# EAGLE design Komfortblinker_ATTINY13 (EAGLE 8.0.1)
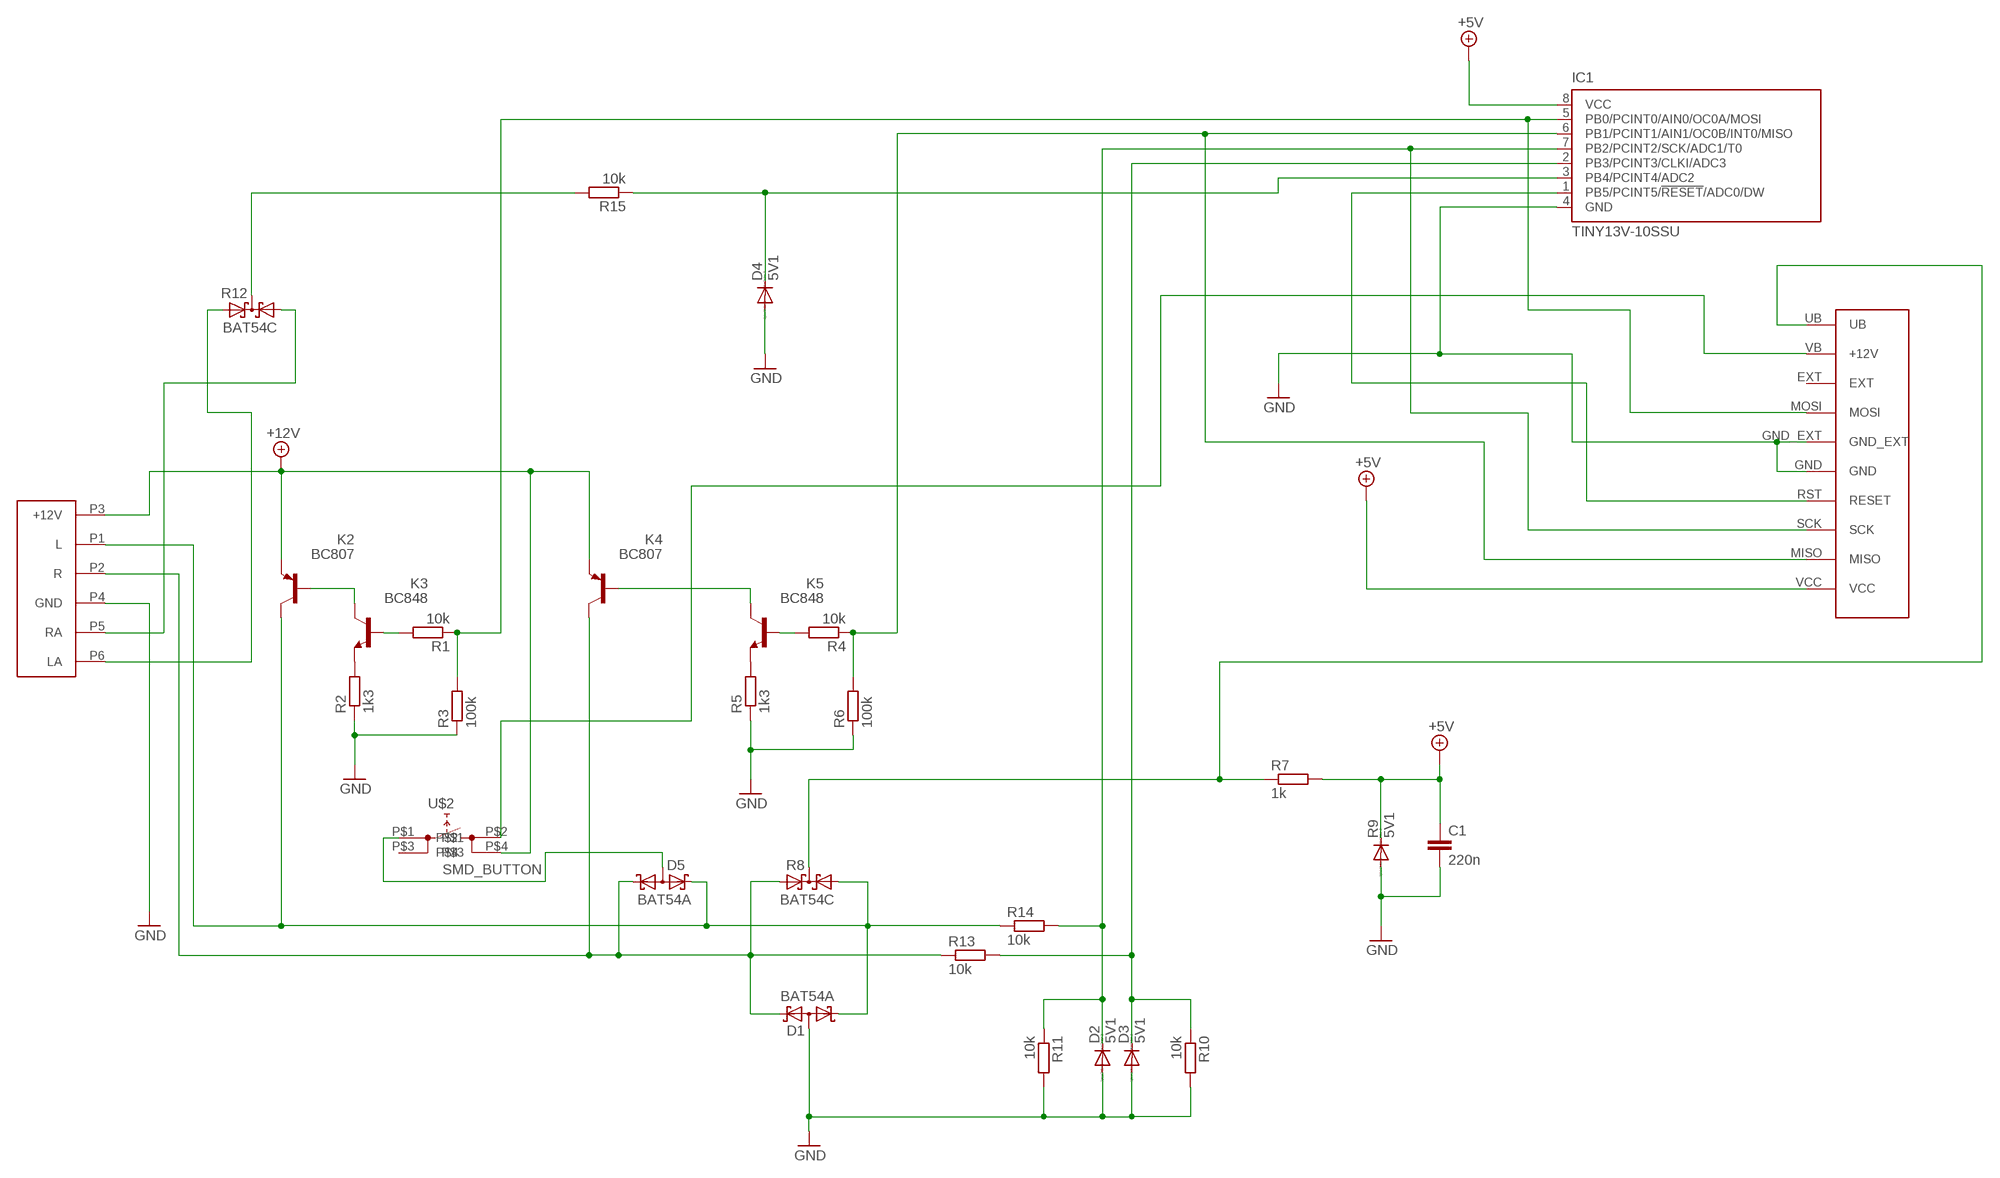
[diagram p0: schematic, sheet 1]

## Parts
C1  220n  C-EUC0805  [C0805]
D1  BAT54A  [SOT23]
D2  5V1  DIODE-SOD123  [SOD123]
D3  5V1  DIODE-SOD123  [SOD123]
D4  5V1  DIODE-SOD123  [SOD123]
D5  BAT54A  [SOT23]
IC1  TINY13V-10SSU  [8S1]
K2  BC807  BC858A-PNP-SOT23-BEC  [SOT23-BEC]
K3  BC848  [SOT23]
K4  BC807  BC858A-PNP-SOT23-BEC  [SOT23-BEC]
K5  BC848  [SOT23]
R1  10k  R-EU_R0805  [R0805]
R2  1k3  R-EU_R0805  [R0805]
R3  100k  R-EU_R0805  [R0805]
R4  10k  R-EU_R0805  [R0805]
R5  1k3  R-EU_R0805  [R0805]
R6  100k  R-EU_R0805  [R0805]
R7  1k  R-EU_M0805  [M0805]
R8  BAT54C  [SOT23]
R9  5V1  DIODE-MINIMELF  [MINIMELF]
R10  10k  R-EU_R0805  [R0805]
R11  10k  R-EU_R0805  [R0805]
R12  BAT54C  [SOT23]
R13  10k  R-EU_M0805  [M0805]
R14  10k  R-EU_M0805  [M0805]
R15  10k  R-EU_R0805  [R0805]
U$2  SMD_BUTTON  [SMD_BUTTON]
U$3  PROGRAMMING  [PROGRAMMING]
U$4  CON-KOMFORT  [CON-KOMFORT]

## Nets
+5V: C1.1 IC1.8(VCC) R7.2 R9.C U$3.VCC
+12V: K2.E K4.E U$2.P$4 U$4.P3(+12V)
+12V2: U$2.P$2 U$3.VB(+12V)
BK2: K2.B K3.3(C)
BK3: K3.1(B) R1.2
BK4: K4.B K5.3(C)
BK5: K5.1(B) R4.2
FB: D4.C IC1.3(PB4/PCINT4/ADC2) R15.1
GND: C1.2 D1.3(AA) D2.A D3.A D4.A IC1.4(GND) R2.1 R3.1 R5.1 R6.1 R9.A R10.2 R11.2 U$3.GND U$3.GND_EXT U$4.P4(GND)
L: D1.1(K1) D5.2(K2) K2.C R8.1(A1) R14.1 U$4.P1(L)
L2: D2.C IC1.7(PB2/PCINT2/SCK/ADC1/T0) R11.1 R14.2 U$3.SCK
LA: R12.2(A2) U$4.P6(LA)
LRA: R12.3(CC) R15.2
LS: IC1.5(PB0/PCINT0/AIN0/OC0A/MOSI) R1.1 R3.2 U$3.MOSI
N$5: K5.2(E) R5.2
N$6: K3.2(E) R2.2
N$9: D5.3(AA) U$2.P$1
R: D1.2(K2) D5.1(K1) K4.C R8.2(A2) R13.1 U$4.P2(R)
R2: D3.C IC1.2(PB3/PCINT3/CLKI/ADC3) R10.1 R13.2
RA: R12.1(A1) U$4.P5(RA)
RESET: IC1.1(PB5/PCINT5/!RESET!/ADC0/DW) U$3.RST(RESET)
RS: IC1.6(PB1/PCINT1/AIN1/OC0B/INT0/MISO) R4.1 R6.2 U$3.MISO
UB: R7.1 R8.3(CC) U$3.UB
Unconnected: U$2.P$3 U$3.EXT

## Library data of the parts
C1 = rcl:C-EU: CAPACITOR, European symbol
D1 D5 = diode:BAT54A: Schottky Diodes Source: Fairchild .. BAT54.pdf
D2-D4 R9 = diode:DIODE-: DIODE
IC1 = atmel_steven:TINY13: 8-bit AVR Microcontroller with 1K Bytes In-System Programmable Flash Source: http://www.atmel.com/dyn/resources/prod_documents/2535S.pdf; MPN: ATTINY13V-10SSU; OC_FARNELL: 1455135; OC_NEWARK: 58M3773
K2 K4 = transistor:*-PNP-: PNP Transistror
K3 K5 = transistor:BC848: NPN TRANSISTOR
R1-R7 R10 R11 R13-R15 = rcl:R-EU_: RESISTOR, European symbol
R8 R12 = diode:BAT54C: Schottky Diodes Source: Fairchild .. BAT54.pdf
U$2 = SMD_Button:SMD_BUTTON
U$3 = Programming_Connector:PROGRAMMING
U$4 = CON-Komfort_2:CON-KOMFORT

## Board
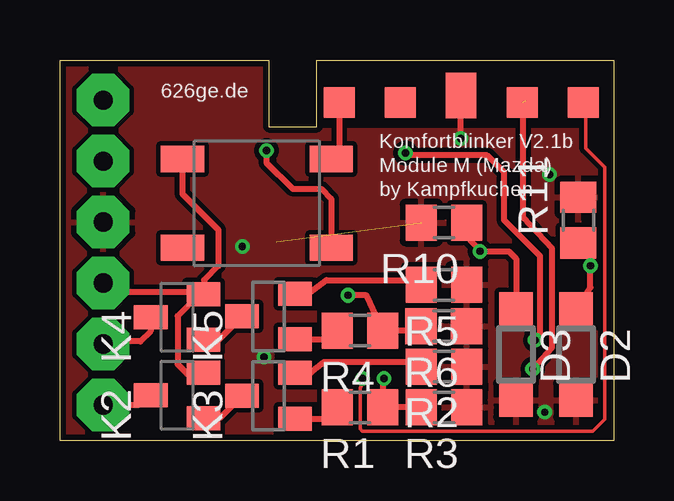
[diagram p1: board, top side]
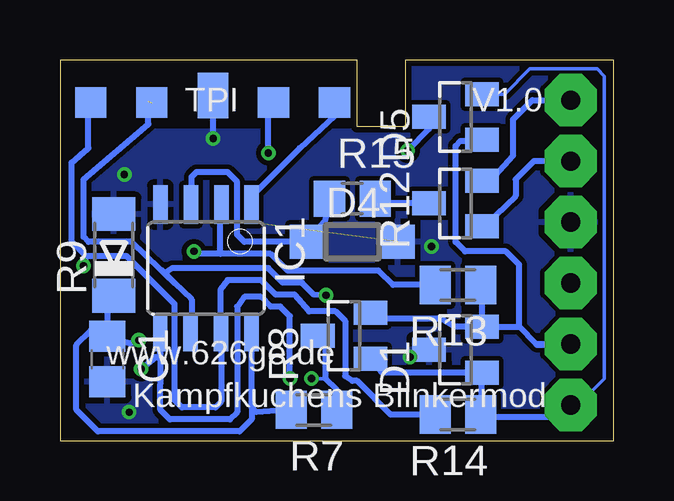
[diagram p2: board, bottom side, seen from below]

Size 23.08 x 15.87 mm. Coordinates in mm from the lower left corner, seen from the top.
Outline: 23.08,15.87 23.08,15.87
Outline: 0,15.87 0,15.87
Outline: 0,15.87 0,0 23.08,0 23.08,15.87
Outline: 0,15.87 8.7,15.87 8.7,13.1 10.7,13.1 10.7,15.87 23.08,15.87
Copper layers (1*16): Top 0.035mm / dielectric 1.5mm / Bottom 0.035mm
Design rules "dirt_cheap_dirty_boards.v1 *": minimum track width 5mil, minimum drill 8mil, track to track 5mil, track to pad 5mil, pad to pad 5mil, via to via 5mil, smd to smd 0mil, copper to edge 10mil, drill to drill 10mil, minimum pad ring 10mil, minimum via ring 6mil, stop-mask expansion 2mil, vias tented up to drill 25mil, thermal gap 10mil

### Footprints (pad centres in the part's own frame; a part is rotated, then mirrored left to right if it is on the bottom)
C0805 = smd 1.3 x 1.5: 1 -0.95,0; 2 0.95,0
SOT23 = smd 1 x 1.4: 1 -0.95,-1.1; 2 0.95,-1.1; 3 0,1.1
SOD123 = smd 1.4 x 1.4: A 1.9,0; C -1.9,0
8S1 = smd 0.6 x 1.6: 1 -1.905,-2.654; 2 -0.645,-2.654; 3 0.625,-2.654; 4 1.895,-2.654; 5 1.905,2.654; 6 0.635,2.654; 7 -0.635,2.654; 8 -1.905,2.654
SOT23-BEC = smd 1 x 1.4: B -0.95,-1.1; C 0,1.1; E 0.95,-1.1
R0805 = smd 1.3 x 1.5: 1 -0.95,0; 2 0.95,0
M0805 = smd 1.3 x 1.6: 1 -0.95,0; 2 0.95,0
MINIMELF = smd 1.4 x 1.8: A 1.7,0; C -1.7,0
SMD_BUTTON = smd 1.8 x 1.1: P$1 -3.1,1.85; P$2 -3.1,-1.85; P$3 3.1,1.85; P$4 3.1,-1.85
PROGRAMMING = smd 1.3 x 1.27: EXT -7.62,0; MOSI -2.54,0; UB 0,0; VB -10.16,0 | smd 1.27 x 1.9 bottom: GND -5.1,0.3 | smd 1.27 x 1.9: GND_EXT -5.1,0.3 | smd 1.3 x 1.27 bottom: MISO -2.54,0; RST -10.16,0; SCK 0,0; VCC -7.62,0
CON-KOMFORT = drill 0.8 pad 2.184 octagon: P1 0,0; P2 2.54,0; P3 5.08,0; P4 7.62,0; P5 10.16,0; P6 12.7,0

### Placement (x,y rotation side)
C1  21.1,3.42 270 bottom
D1  6.6,3.8 90 bottom
D2  21.5,3.6 270 top
D3  19,3.6 270 top
D4  10.9,8.3 0 bottom
D5  6.6,13.5 90 bottom
IC1  17,7.2 180 bottom
K2  4.88,1.9 90 top
K3  8.69,1.89 90 top
K4  4.88,5.16 90 top
K5  8.69,5.19 90 top
R1  12.5,1.4 180 top
R2  16,3.1 180 top
R3  16,1.4 180 top
R4  12.5,4.6 180 top
R5  16,6.5 180 top
R6  15.99,4.78 180 top
R7  12.5,1.3 180 bottom
R8  11.24,4.39 90 bottom
R9  20.84,7.75 90 bottom
R10  16,9.1 180 top
R11  21.6,9.2 90 top
R12  6.6,9.9 90 bottom
R13  6.5,6.5 180 bottom
R14  6.5,1.1 180 bottom
R15  10.9,10.1 0 bottom
U$2  8.2,9.9 180 top
U$3  21.8,14.1 0 top
U$4  1.8,1.5 90 top

### Tracks (layer width: path | path; a pad name or v marks a point on that pad's centre or on a via)
+5V  (via drill 0.3 pad 0.61)
  Top 0.254: v19.8,4.2 20,4.5 20,7.7 18.5,9.2 18.5,11.2 17.8,11.9 14.5,11.9 v14.4,12
  Bottom 0.254: C1.1 21.1,6.02 R9.C | R7.2 14.9,1.2 15.1,1.4 | 15.1,1.4 15.1,0.9 15.6,0.4 21.5,0.4 22.4,1.3 22.4,4 21.8,4.6 21.34,4.6 C1.1 | C1.1 20.17,4.07 v19.8,4.2 | v14.4,12 14.4,14.18 U$3.VCC | 15.1,1.4 15.1,2.39 IC1.8
+12V
  Top 0.254: 6,6.13 5.8,6.2 2.28,6.2 U$4.P3 | K2.E 5.93,2.8 5.3,2.8 4.9,3.2 4.9,5.2 5.81,6.11 K4.E 6,6.13 | U$2.P$4 5.1,10.3 6.6,8.8 6.6,7.3 6,6.7 6,6.13
+12V2
  Top 0.254: 11.3,13.76 U$3.VB 11.64,12.09 U$2.P$2
BK2
  Top 0.254: K2.B 6.66,0.95 K3.3
BK3
  Top 0.254: K3.1 11.32,0.94 R1.2
BK4
  Top 0.254: K4.B 6.61,4.21 K5.3
BK5
  Top 0.254: K5.1 11.19,4.24 R4.2
FB
  Bottom 0.254: R15.1 12.05,9.15 D4.C 15.4,8.3 15.7,8.6 15.7,10.8 16.1,11.2 17.4,11.2 17.6,11 17.6,10.3 | 17.6,10.3 17.6,9.43 | IC1.3 17.62,10.28 17.6,10.3
GND  (via drill 0.3 pad 0.61)  (1 unrouted)
  Top 0.254: v16.7,12.6 U$3.GND
  Bottom 0.254: v16.7,12.6 U$3.GND
  other vias: 7.6,8.1 8.5,3.5 20.2,1.2 20.4,11.1
  pour Bottom (isolate 0.2): 0.2,15.6 0.2,0.2 22.9,0.2 22.9,12.9 8.5,12.9 8.5,15.6
  pour Top (isolate 0.2): 0.2,15.6 0.2,0.2 22.9,0.2 22.9,12.9 8.6,12.9 8.6,15.6
L
  Top 0.254: U$4.P1 3.28,1.5 K2.C
  Bottom 0.15: D5.2 4.55,14.45 3.5,15.5 0.7,15.5 0.4,15.2 0.4,2.6 0.9,2.1 1,2.1 U$4.P1
  Bottom 0.254: R8.1 9.66,2.85 D1.1 5.5,1.15 R14.1 5.45,1 2.4,1 U$4.P1
L2  (via drill 0.3 pad 0.61)
  Top 0.254: D2.C 22.1,6.4 v22.1,7.3 22.1,7.75 R11.1
  Bottom 0.254: R14.2 9.3,1.1 10.7,2.5 10.9,2.5 11.2,2.7 11.2,5 11.6,5.4 12.7,5.4 13.3,6.1 14.1,6.1 14.7,6.7 16.1,6.7 16.4,6.3 16.4,4.58 IC1.7 16.36,1.64 16.6,1.4 18,1.4 18.3,1.7 18.3,5.7 20.3,7.7 22,7.7 | 22,7.7 22.6,8.3 22.6,11.6 21.9,12.2 21.9,14.3 U$3.SCK | 22,7.7 22.1,7.2 v22.1,7.3
LA
  Bottom 0.254: R12.2 5.15,10.85 4.2,11.9 4.2,13.4 3.4,14.2 U$4.P6
LRA
  Bottom 0.254: R12.3 9.95,9.9 R15.2
LS  (via drill 0.3 pad 0.61)
  Top 0.254: R3.2 R1.1 13.45,2.05 v13.5,2.6 | U$3.MOSI 19.3,14.36 19.3,9.3 20.5,8 20.5,3.9 v19.7,3
  Bottom 0.254: v19.7,3 19.1,3.5 18.91,3.5 | 18.91,3.5 18.91,2.5 | 18.91,3.5 IC1.5 18.9,2.39 18.9,1.3 18.5,0.9 16,0.9 15.7,1.2 15.7,5.6 15.4,6 14.7,6 14.3,5.6 13.9,5.6 13.5,5.2 v13.5,2.6
N$5
  Top 0.254: 9.79,6.11 K5.2 | K5.2 10.24,6.14 | K5.2 10.34,6.14 11.1,6.7 14.65,6.7 R5.2
N$6
  Top 0.254: K3.2 10.44,2.84 11,3.3 14.55,3.3 R2.2
N$9  (via drill 0.3 pad 0.61)
  Top 0.254: v8.6,12.1 8.6,11.6 9.7,10.5 10.9,10.5 11.3,10.1 U$2.P$1
  Bottom 0.254: D5.3 7.7,13 v8.6,12.1
R
  Top 0.254: K4.C 3.78,4.58 3.35,4.15 2.41,4.15 U$4.P2
  Bottom 0.254: D1.2 5.5,6.45 R13.1 | D1.2 6.65,4.75 7.2,5.1 10.48,5.1 R8.2 | D1.2 3.95,4.75 | 3.24,4.04 3.2,4 2.16,4 U$4.P2 3.24,4.04 | 3.24,4.04 3.95,4.75 | 3.95,4.75 3.95,7.35 4.5,7.9 6.2,7.9 6.6,8.3 6.6,12.3 6.4,12.5 5.55,12.5 D5.1
R2  (via drill 0.3 pad 0.61)
  Top 0.254: D3.C 19,7.6 18.7,7.9 v17.5,7.9 16.95,8.5 R10.1
  Bottom 0.254: R13.2 9.2,6.5 9.8,7.1 13.6,7.1 14.3,7.8 16.4,7.8 | 16.4,7.8 16.4,9.76 IC1.2 | 16.4,7.8 17.4,7.8 v17.5,7.9
RA
  Bottom 0.254: U$4.P5 3.34,11.66 4.1,10.9 4.1,10.2 5.35,9 R12.1
RESET
  Bottom 0.254: U$3.RST 11.64,13.56 13.1,12.2 15.1,10.2 | 15.1,10.2 15.1,9.41 | IC1.1 15.1,10.2
RS  (via drill 0.3 pad 0.61)  (1 unrouted)
  Top 0.254: R6.2 15.16,4.6 R4.1 12.77,6.07 v12,6.07
  Bottom 0.254: 19.4,14.16 19.4,13.2 22.1,10.9 22.1,8.5 21.9,8.3 20.1,8.3 18.32,6.59 | 18.32,6.59 17.6,5.9 17.6,4.58 IC1.6 | v12,6.07 12.5,6.1 13,6.6 13.8,6.6 14.4,7.2 18.4,7.2 18.71,6.99 | 18.54,6.8 18.67,6.93 18.86,7.13 18.71,6.99 | 18.71,6.99 18.32,6.59
UB  (via drill 0.3 pad 0.61)
  Top 0.15: v12.6,2.6 12.6,2.4 12.5,2.2 12.5,0.5 12.6,0.4 22.2,0.4 22.7,0.9 22.7,11.4 21.9,12.2 21.9,14 U$3.UB
  Bottom 0.15: 12,2.6 v12.6,2.6
  Bottom 0.254: 11.6,1.25 R7.1 11.55,2.15 12,2.6 12,4.04 R8.3

### Text on the board
tPlace: 626ge.de | Komfortblinker V2.1b | Module M (Mazda) | by Kampfkuchen
bNames: V1.0 | TPI | www.626ge.de | Kampfkuchens Blinkermod
_tNames: R7 | D1 | R13 | T1 | R10 | C1 | IC1 | D2 | R11 | R8 | R6 | R9 | T3 | T4 | R5 | R1 | R2 | T2